# EAGLE design MiniBee (EAGLE 5.06)
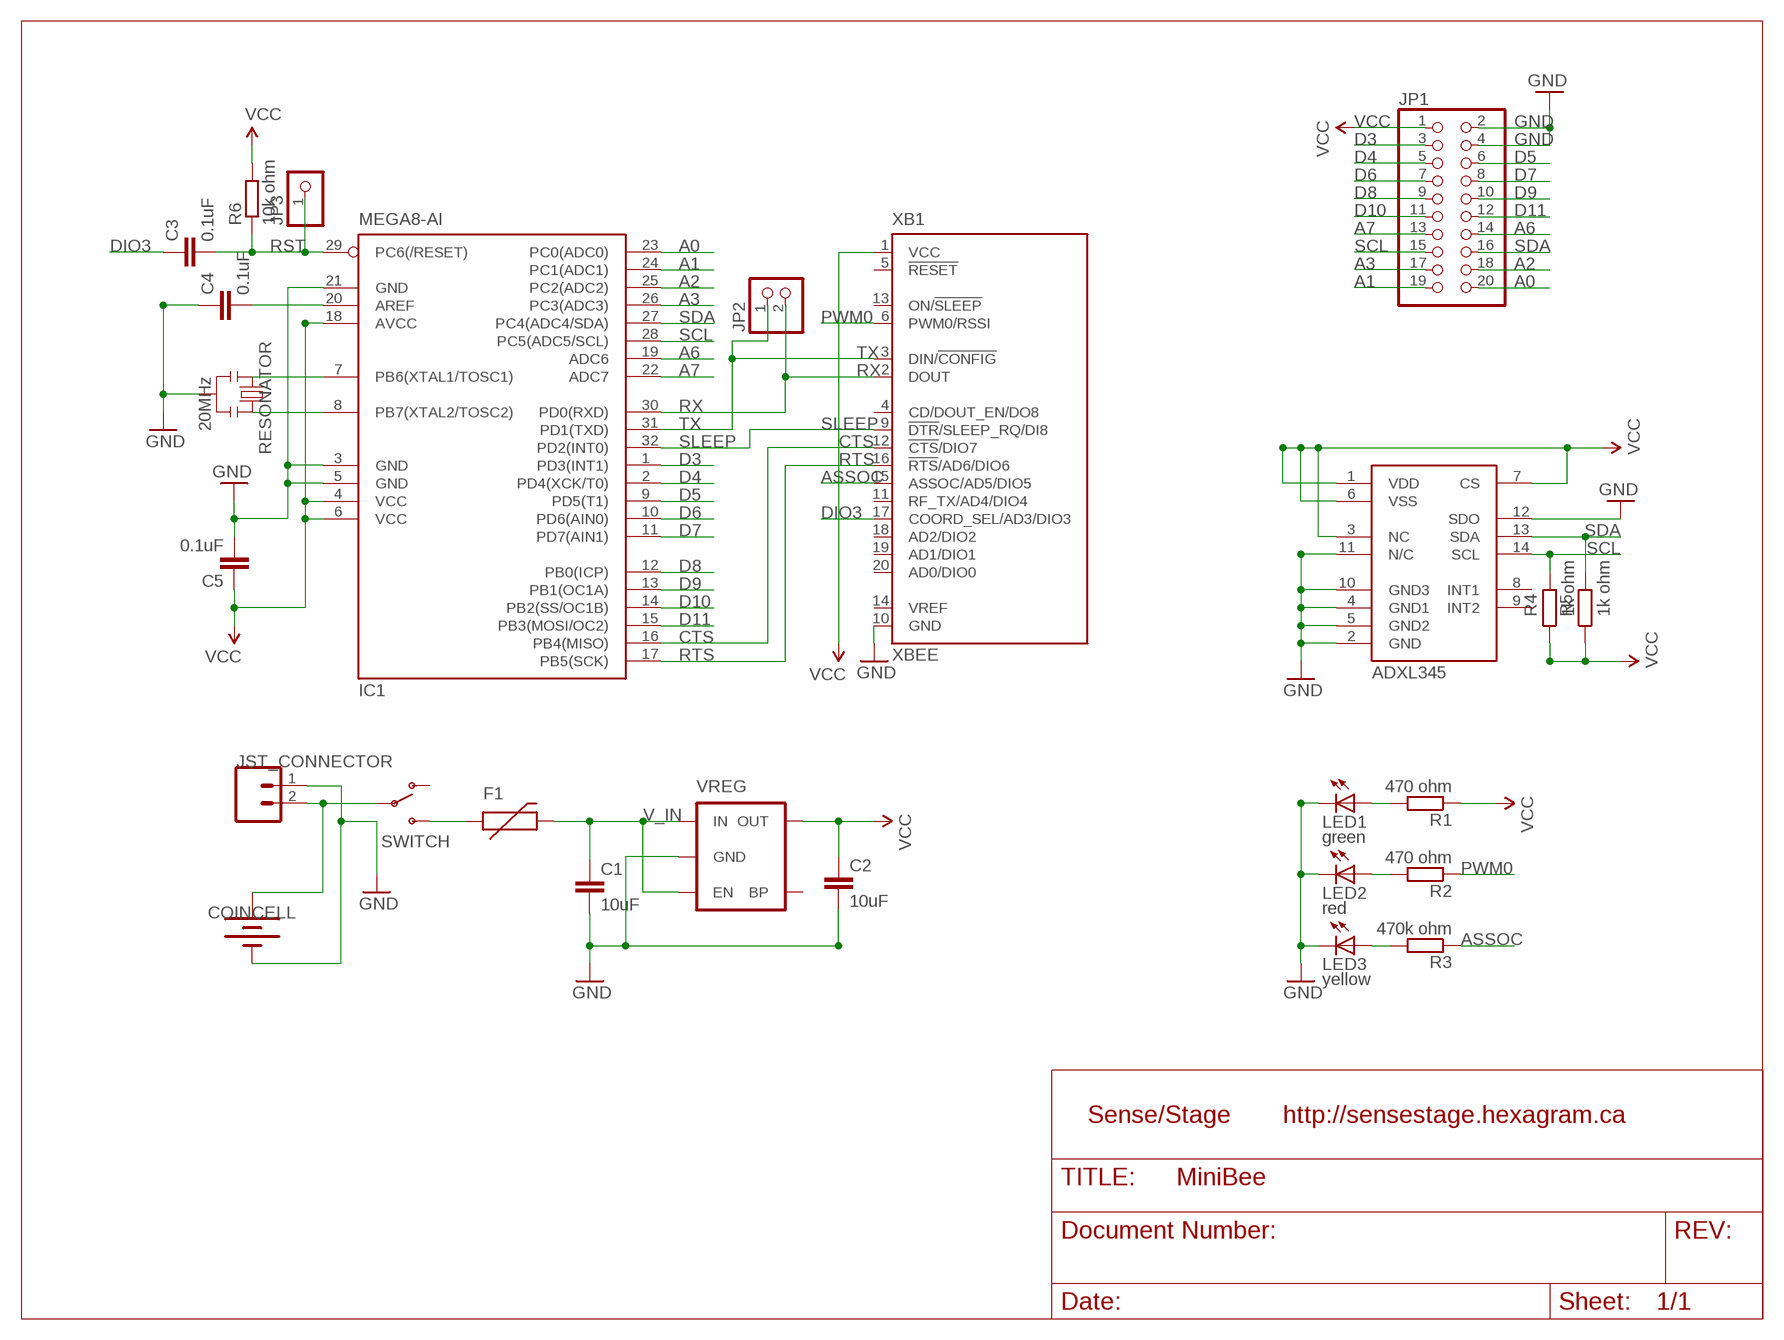
[diagram p0: schematic, sheet 1]

## Parts
C1  10uF  C-EUC0805  [C0805]
C2  10uF  C-EUC0805  [C0805]
C3  0.1uF  C-EUC0402  [C0402]
C4  0.1uF  C-EUC0402  [C0402]
C5  0.1uF  C-EUC0402  [C0402]
COINCELL  COINCELL  KEYSTONE_BATTERY_HOLDER  [KEYSTONE_BATTERY_HOLDER]
F1  PTCSMD  [PTC-1206]
IC1  MEGA8-AI  [TQFP32-08]
JP1  PINHD-2X10  [2X10]
JP2  PINHD-1X2  [1X02]
JP3  PINHD-1X1  [1X01]
JST_CONNECTOR  JST_CONNECTOR  M02-JST-2MM-SMT  [S2B-PH]
LED1  green  LEDCHIP-LED0603  [CHIP-LED0603]
LED2  red  LEDCHIP-LED0603  [CHIP-LED0603]
LED3  yellow  LEDCHIP-LED0603  [CHIP-LED0603]
R1  470 ohm  R-EU_R0402  [R0402]
R2  470 ohm  R-EU_R0402  [R0402]
R3  470k ohm  R-EU_R0402  [R0402]
R4  1k ohm  R-EU_R0402  [R0402]
R5  1k ohm  R-EU_R0402  [R0402]
R6  10k ohm  R-EU_R0402  [R0402]
RESONATOR  20MHz  RESONATORSMD  [RESONATOR-SMD]
SWITCH  SWITCH  PCM_SWITCH  [PCM_SWITCH_RA]
U1  ADXL345  [LGA14]
VREG  V_REG_LDOSMD  [SOT23-5]
XB1  XBEE  [XBEE]

## Nets
A0: IC1.23(PC0(ADC0)) JP1.20
A1: IC1.24(PC1(ADC1)) JP1.19
A2: IC1.25(PC2(ADC2)) JP1.18
A3: IC1.26(PC3(ADC3)) JP1.17
A6: IC1.19(ADC6) JP1.14
A7: IC1.22(ADC7) JP1.13
ASSOC: R3.1 XB1.15(ASSOC/AD5/DIO5)
CTS: IC1.16(PB4(MISO)) XB1.12(!CTS!/DIO7)
D3: IC1.1(PD3(INT1)) JP1.3
D4: IC1.2(PD4(XCK/T0)) JP1.5
D5: IC1.9(PD5(T1)) JP1.6
D6: IC1.10(PD6(AIN0)) JP1.7
D7: IC1.11(PD7(AIN1)) JP1.8
D8: IC1.12(PB0(ICP)) JP1.9
D9: IC1.13(PB1(OC1A)) JP1.10
D10: IC1.14(PB2(SS/OC1B)) JP1.11
D11: IC1.15(PB3(MOSI/OC2)) JP1.12
DIO3: C3.1 XB1.17(COORD_SEL/AD3/DIO3)
GND: C1.2 C2.2 C4.1 C5.2 COINCELL.- IC1.3(GND) IC1.5(GND) IC1.21(GND) JP1.2 JP1.4 JST_CONNECTOR.1 LED1.C LED2.C LED3.C RESONATOR.2 U1.2(GND) U1.4(GND1) U1.5(GND2) U1.10(GND3) U1.11(N/C) U1.12(SDO) VREG.2(GND) XB1.10(GND)
N$1: IC1.7(PB6(XTAL1/TOSC1)) RESONATOR.1
N$2: IC1.8(PB7(XTAL2/TOSC2)) RESONATOR.3
N$3: LED1.A R1.2
N$4: COINCELL.+ JST_CONNECTOR.2 SWITCH.2(P)
N$6: LED2.A R2.2
N$7: LED3.A R3.2
N$8: F1.1 SWITCH.3(S)
N$9: C4.2 IC1.20(AREF)
PWM0: R2.1 XB1.6(PWM0/RSSI)
RST: C3.2 IC1.29(PC6(/RESET)) JP3.1 R6.1
RTS: IC1.17(PB5(SCK)) XB1.16(!RTS!/AD6/DIO6)
RX: IC1.30(PD0(RXD)) JP2.2 XB1.2(DOUT)
SCL: IC1.28(PC5(ADC5/SCL)) JP1.15 R4.2 U1.14(SCL)
SDA: IC1.27(PC4(ADC4/SDA)) JP1.16 R5.2 U1.13(SDA)
SLEEP: IC1.32(PD2(INT0)) XB1.9(!DTR!/SLEEP_RQ/DI8)
TX: IC1.31(PD1(TXD)) JP2.1 XB1.3(DIN/!CONFIG)
V_IN: C1.1 F1.2 VREG.1(IN) VREG.3(EN)
VCC: C2.1 C5.1 IC1.4(VCC) IC1.6(VCC) IC1.18(AVCC) JP1.1 R1.1 R4.1 R5.1 R6.2 U1.1(VDD) U1.3(NC) U1.6(VSS) U1.7(CS) VREG.5(OUT) XB1.1(VCC)
Unconnected: SWITCH.1(O) U1.8(INT1) U1.9(INT2) VREG.4(BP) XB1.4(CD/DOUT_EN/DO8) XB1.5(!RESET) XB1.11(RF_TX/AD4/DIO4) XB1.13(ON/!SLEEP) XB1.14(VREF) XB1.18(AD2/DIO2) XB1.19(AD1/DIO1) XB1.20(AD0/DIO0)

## Notes on the sheet
- Sense/Stage | http://sensestage.hexagram.ca

## Library data of the parts
C1-C5 = rcl:C-EU: CAPACITOR, European symbol
COINCELL = myShit:KEYSTONE_BATTERY_HOLDER
F1 = SparkFun:PTC: Resettable Fuse PTC Resettable Fuse. Spark Fun Electronics SKU : COM-08357
IC1 = atmel:MEGA8: MICROCONTROLLER 8 Kbytes FLASH, 1 kbytes SRAM, 512 bytes EEPROM, USART, 6-channel 10 bit ADC, 2-channel 8 bit ADC Pin compatible with Atmega48, ATMega88, ATMega168 Source: avr.lbr
JP1 = myShit:PINHD-2X10: PIN HEADER
JP2 = myShit:PINHD-1X2: PIN HEADER
JP3 = myShit:PINHD-1X1: PIN HEADER
JST_CONNECTOR = SparkFun:M02: Header 2 Standard 2-pin 0.1" header. Use with straight break away headers (SKU : PRT-00116), right angle break away headers (PRT-00553), swiss pins (PRT-00743), machine pins (PRT-00117), and female headers (PRT-00115). Molex polarized connector foot print use with SKU : PRT-08233 with associated crimp pins and housings.
LED1-LED3 = led:LED: LED OSRAM: - CHIPLED LG R971, LG N971, LY N971, LG Q971, LY Q971, LO R971, LY R971 LH N974, LH R974 LS Q976, LO Q976, LY Q976 LO Q996 - Hyper CHIPLED LW Q18S LB Q993, LB Q99A, LB R99A - SideLED LS A670, LO A670, LY A670, LG A670, LP A670 LB A673, LV A673, LT A673, LW A673 LH A674 LY A675 LS A676, LA A676, LO A676, LY A676, LW A676 LS A679, LY A679, LG A679 - Hyper Micro SIDELED® LS Y876, LA Y876, LO Y876, LY Y876 LT Y87S - SmartLED LW L88C, LW L88S LB L89C, LB L89S, LG L890 LS L89K, LO L89K, LY L89K LS L896, LA L896, LO L896, LY L896 - TOPLED LS T670, LO T670, LY T670, LG T670, LP T670 LSG T670, LSP T670, LSY T670, LOP T670, LYG T670 LG T671, LOG T671, LSG T671 LB T673, LV T673, LT T673, LW T673 LH T674 LS T676, LA T676, LO T676, LY T676, LB T676, LH T676, LSB T676, LW T676 LB T67C, LV T67C, LT T67C, LS T67K, LO T67K, LY T67K, LW E67C LS E67B, LA E67B, LO E67B, LY E67B, LB E67C, LV E67C, LT E67C LW T67C LS T679, LY T679, LG T679 LS T770, LO T770, LY T770, LG T770, LP T770 LB T773, LV T773, LT T773, LW T773 LH T774 LS E675, LA E675, LY E675, LS T675 LS T776, LA T776, LO T776, LY T776, LB T776 LHGB T686 LT T68C, LB T68C - Hyper Mini TOPLED® LB M676 - Mini TOPLED Santana® LG M470 LS M47K, LO M47K, LY M47K Source: http://www.osram.convergy.de LUXEON: - LUMILED® LXK2-PW12-R00, LXK2-PW12-S00, LXK2-PW14-U00, LXK2-PW14-V00 LXK2-PM12-R00, LXK2-PM12-S00, LXK2-PM14-U00 LXK2-PE12-Q00, LXK2-PE12-R00, LXK2-PE12-S00, LXK2-PE14-T00, LXK2-PE14-U00 LXK2-PB12-K00, LXK2-PB12-L00, LXK2-PB12-M00, LXK2-PB14-N00, LXK2-PB14-P00, LXK2-PB14-Q00 LXK2-PR12-L00, LXK2-PR12-M00, LXK2-PR14-Q00, LXK2-PR14-R00 LXK2-PD12-Q00, LXK2-PD12-R00, LXK2-PD12-S00 LXK2-PH12-R00, LXK2-PH12-S00 LXK2-PL12-P00, LXK2-PL12-Q00, LXK2-PL12-R00 Source: www.luxeon.com KINGBRIGHT: KA-3528ASYC Source: www.kingbright.com
R1-R6 = rcl:R-EU_: RESISTOR, European symbol
RESONATOR = SparkFun:RESONATOR: Resonator Small SMD resonator. This is the itty bitty 10/20MHz resonators with built in caps. CSTCE10M0G55 and CSTCE20M0V53. Footprint has been reviewed closely but hasn't been tested yet.
SWITCH = myShit:PCM_SWITCH
U1 = SparkFun:ADXL345
VREG = SparkFun:V_REG_LDO: Voltage Regulator LDO Standard 150mA LDO voltage regulator in SOT-23 layout. Micrel part MIC5205. BP (by-pass) pin is used to lower output noise with 470pF cap.
XB1 = maxstream:XBEE: XBee (TM) /XBee-PRO(TM) OEM RF Modules Source: MaxStream, Inc. xbee_productmanual.pdf

## Board
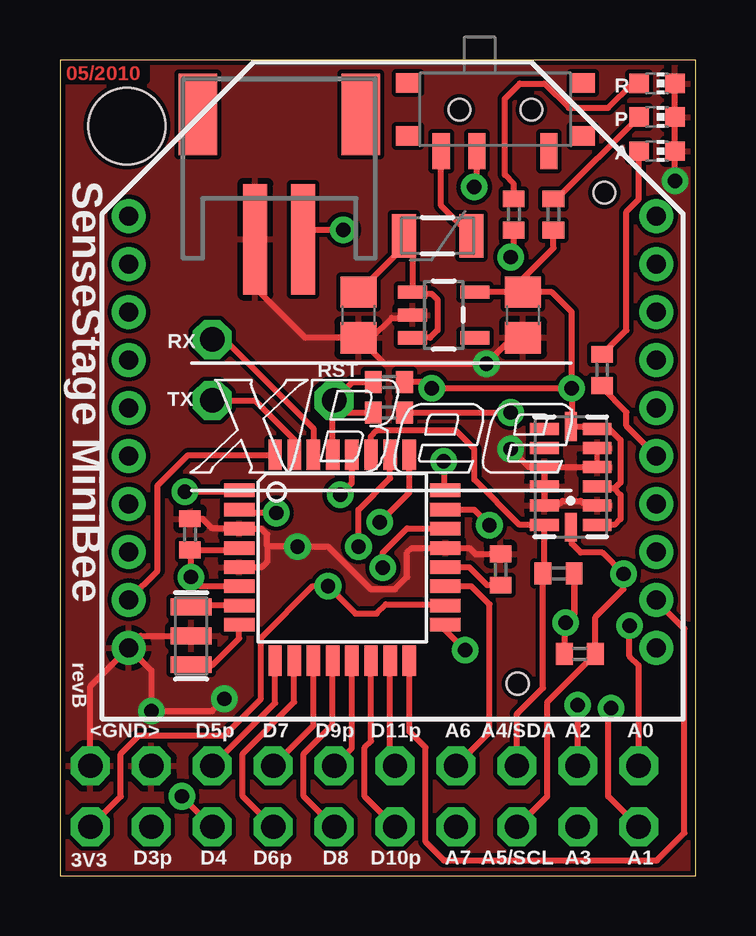
[diagram p1: board, top side]
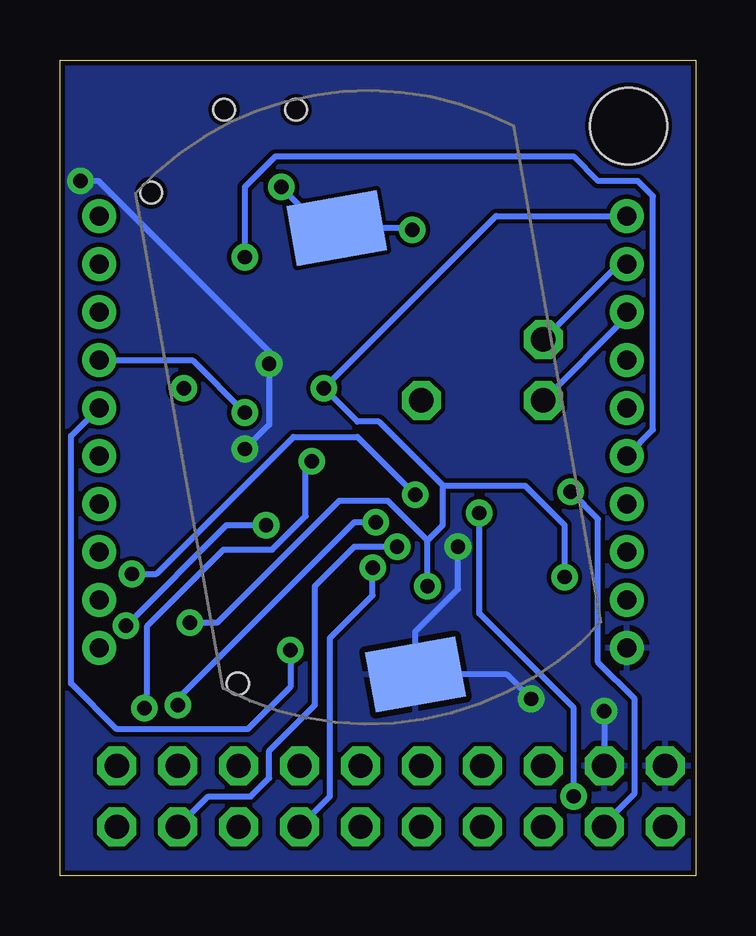
[diagram p2: board, bottom side, seen from below]

Size 26.5 x 34 mm. Coordinates in mm from the lower left corner, seen from the top.
Outline: 0,0 26.5,0 26.5,34 0,34 0,0
Copper layers (1*16): Top 0.035mm / dielectric 1.5mm / Bottom 0.035mm
Design rules "APC": minimum track width 7mil, minimum drill 20mil, track to track 7mil, track to pad 7mil, pad to pad 7mil, via to via 7mil, smd to smd 0mil, copper to edge 8mil, drill to drill 8mil, minimum pad ring 12mil, minimum via ring 10mil, stop-mask expansion 4mil, vias tented up to drill 25mil, thermal gap 10mil
Holes 3.2 mm at 2.79,31.24

### Footprints (pad centres in the part's own frame; a part is rotated, then mirrored left to right if it is on the bottom)
C0805 = smd 1.3 x 1.5: 1 -0.95,0; 2 0.95,0
C0402 = smd 0.7 x 0.9: 1 -0.65,0; 2 0.65,0
KEYSTONE_BATTERY_HOLDER = smd 2.54 x 3.81: + 7.595,0; - -11.303,0 | hole 0.914: 10.389,7.366; -10.389,7.366
PTC-1206 = smd 1 x 1.8: 1 -1.4,0; 2 1.4,0
TQFP32-08 = smd 1.27 x 0.559: 1 -4.293,2.8; 2 -4.293,2; 3 -4.293,1.2; 4 -4.293,0.4; 5 -4.293,-0.4; 6 -4.293,-1.2; 7 -4.293,-2; 8 -4.293,-2.8; 17 4.293,-2.8; 18 4.293,-2; 19 4.293,-1.2; 20 4.293,-0.4; 21 4.293,0.4; 22 4.293,1.2; 23 4.293,2; 24 4.293,2.8 | smd 0.559 x 1.27: 9 -2.8,-4.293; 10 -2,-4.293; 11 -1.2,-4.293; 12 -0.4,-4.293; 13 0.4,-4.293; 14 1.2,-4.293; 15 2,-4.293; 16 2.8,-4.293; 25 2.8,4.293; 26 2,4.293; 27 1.2,4.293; 28 0.4,4.293; 29 -0.4,4.293; 30 -1.2,4.293; 31 -2,4.293; 32 -2.8,4.293
2X10 = drill 1.016 octagon: 1 -11.43,-1.27; 2 -11.43,1.27; 3 -8.89,-1.27; 4 -8.89,1.27; 5 -6.35,-1.27; 6 -6.35,1.27; 7 -3.81,-1.27; 8 -3.81,1.27; 9 -1.27,-1.27; 10 -1.27,1.27; 11 1.27,-1.27; 12 1.27,1.27; 13 3.81,-1.27; 14 3.81,1.27; 15 6.35,-1.27; 16 6.35,1.27; 17 8.89,-1.27; 18 8.89,1.27; 19 11.43,-1.27; 20 11.43,1.27
1X02 = drill 1.016 octagon: 1 -1.27,0; 2 1.27,0
1X01 = drill 1.016 octagon: 1 0,0
S2B-PH = smd 1 x 4.6: 1 -1,-3.7; 2 1,-3.7 | smd 1.6 x 3.4: NC1 -3.4,1.5; NC2 3.4,1.5
CHIP-LED0603 = smd 0.8 x 0.8: A 0,-0.75; C 0,0.75
R0402 = smd 0.7 x 0.9: 1 -0.65,0; 2 0.65,0
RESONATOR-SMD = smd 0.7 x 1.7: 1 -1.2,0; 2 0,0; 3 1.2,0
PCM_SWITCH_RA = smd 0.711 x 1.499: 1 -2.235,1.74; 2 0.762,1.74; 3 2.261,1.74 | smd 0.991 x 0.813: P$1 -3.645,1.105; P$2 -3.645,-1.105; P$4 3.645,-1.105; P$5 3.645,1.105 | hole 0.889: 1.499,0; -1.499,0
LGA14 = smd 0.5 x 1.2: 1 2,1.1; 2 1.2,1.1; 3 0.4,1.1; 4 -0.4,1.1; 5 -1.2,1.1; 6 -2,1.1; 8 -2,-1.1; 9 -1.2,-1.1; 10 -0.4,-1.1; 11 0.4,-1.1; 12 1.2,-1.1; 13 2,-1.1 | smd 1.2 x 0.5: 7 -2.1,0; 14 2.1,0
SOT23-5 = smd 0.55 x 1.2: 1 -0.95,-1.3; 2 0,-1.3; 3 0.95,-1.3; 4 0.95,1.3; 5 -0.95,1.3
XBEE = drill 0.8 pad 1.27 round: 1 -11,9; 2 -11,7; 3 -11,5; 4 -11,3; 5 -11,1; 6 -11,-1; 7 -11,-3; 8 -11,-5; 9 -11,-7; 10 -11,-9; 11 11,-9; 12 11,-7; 13 11,-5; 14 11,-3; 15 11,-1; 16 11,1; 17 11,3; 18 11,5; 19 11,7; 20 11,9

### Placement (x,y rotation side)
C1  12.45,23.37 270 top
C2  19.3,23.37 270 top
C3  13.72,19.3 180 top
C4  18.37,12.75 270 top
C5  5.42,14.22 90 top
COINCELL  13.64,19.51 100 bottom
F1  15.75,26.67 180 top
IC1  11.77,13.25 0 top
JP1  12.7,3.3 0 top
JP2  6.35,21.08 90 top
JP3  11.43,19.81 0 top
JST_CONNECTOR  9.14,30.23 0 top
LED1  24.89,31.62 270 top
LED2  24.89,33.02 270 top
LED3  24.89,30.2 270 top
R1  20.57,27.56 90 top
R2  18.92,27.56 90 top
R3  470 ohm  [R0402]  22.61,21.08 90 top
R4  21.68,9.24 0 top
R5  20.79,12.59 180 top
R6  13.72,20.57 0 top
RESONATOR  12MHz  [RESONATOR-SMD]  5.47,9.99 270 top
SWITCH  18.16,31.93 180 top
U1  21.3,16.62 270 top
VREG  16,23.37 270 top
XB1  13.87,18.49 0 top

### Tracks (layer width: path | path; a pad name or v marks a point on that pad's centre or on a via)
A0  (via drill 0.6)
  Top 0.254: v17.91,14.61 17.27,15.24 16.08,15.24 IC1.23 | JP1.20 24.13,8.76 23.75,9.14 v23.75,10.41
  Bottom 0.254: v23.75,10.41 19.56,14.61 v17.91,14.61
A1  (via drill 0.6)
  Top 0.254: JP1.19 22.86,3.3 22.86,6.86 v22.99,6.99 | v16,17.27 16,16.11 IC1.24
  Bottom 0.254: v22.99,6.99 22.99,7.11 22.86,7.24 22.86,10.41 19.68,13.59 17.65,13.59 16.26,14.99 16.26,17.02 v16,17.27
A2  (via drill 0.6)
  Top 0.254: IC1.25 14.57,15.97 v13.34,14.73 | JP1.18 v21.59,7.11
  Bottom 0.254: v21.59,7.11 21.59,7.37 14.22,14.73 v13.34,14.73
A3  (via drill 0.6)
  Top 0.254: IC1.26 13.77,16.56 12.45,15.24 v12.45,13.72
  Bottom 0.254: JP1.17 20.32,3.3 18.54,3.3 17.78,4.06 17.78,5.21 15.88,7.11 15.88,12.06 14.22,13.72 v12.45,13.72
A6
  Top 0.254: IC1.19 17.16,12.05 17.91,11.3 17.91,5.97 JP1.14
A7  (via drill 0.6)
  Top 0.254: IC1.22 16.04,14.48 14.48,14.48 13.46,13.46 v13.46,12.83
  Bottom 0.254: JP1.13 15.24,3.3 15.24,9.91 13.46,11.68 v13.46,12.83
ASSOC
  Top 0.254: R3.1 22.61,20.32 23.62,19.3 23.62,18.74 XB1.15
CTS
  Top 0.254: IC1.16 14.57,6 15.24,5.33 15.24,1.4 16,0.64 24.89,0.64 26.04,1.78 26.04,10.29 24.87,11.45 XB1.12
D3  (via drill 0.6)
  Top 0.254: v5.21,16 7.42,16 IC1.1
  Bottom 0.254: JP1.3 3.81,2.16 2.54,3.43 2.54,7.37 4.06,8.89 4.06,14.86 v5.21,16
D4  (via drill 0.6)
  Top 0.254: JP1.5 v5.08,3.3 | v9.02,15.11 7.62,15.11 IC1.2
  Bottom 0.254: v5.08,3.3 5.08,6.99 9.02,10.92 v9.02,15.11
D5
  Top 0.254: IC1.9 8.97,7.19 JP1.6
D6
  Top 0.254: IC1.10 9.77,7.23 7.62,5.08 7.62,3.3 JP1.7
D7
  Top 0.254: IC1.11 10.57,6.25 JP1.8
D8
  Top 0.254: IC1.12 11.37,6.29 10.16,5.08 10.16,3.3 JP1.9
D9
  Top 0.254: IC1.13 12.17,5.31 JP1.10
D10
  Top 0.254: IC1.14 12.97,5.6 12.7,5.33 12.7,3.3 JP1.11
D11
  Top 0.254: IC1.15 13.77,4.77 JP1.12
DIO3  (via drill 0.6)
  Top 0.254: C3.1 v18.8,19.3
  Bottom 0.254: v18.8,19.3 20.95,21.46 24.84,21.46 XB1.17
GND  (via drill 0.6)
  Top 0.203: U1.4 U1.5
  Top 0.254: U1.10 U1.11 U1.12 20.63,15.42 20.7,15.49 20.83,15.49 20.95,15.62 21.72,15.62 21.84,15.49 22.32,15.49 U1.2 | U1.10 U1.4 | C4.1 17.32,13.4 17.07,13.65 IC1.21 14.67,13.65 14.48,13.46 14.48,12.45 13.97,11.94 12.95,11.94 11.18,13.72 v9.91,13.72 8.64,13.72 | C5.2 5.96,14.87 6.35,14.48 7.45,14.48 IC1.3 8.41,14.45 8.64,14.22 8.64,13.72 | IC1.5 8.41,12.85 8.64,13.08 8.64,13.72 | C1.2 13.02,22.42 13.84,23.24 14.57,23.24 VREG.2 | C1.2 10.22,22.42 8.13,24.51 8.13,26.51 JST_CONNECTOR.1 | U1.10 19.55,17.02 v18.8,17.78 | C2.2 18.86,22.42 v17.78,21.34 13.53,21.34 C1.2 | v25.65,28.96 v25.64,28.97 LED3.C LED1.C LED2.C | RESONATOR.2 3.37,9.99 XB1.10 | JP1.2 1.27,7.89 XB1.10 | XB1.10 3.81,8.55 v3.81,6.86 6.35,6.86 v6.86,7.37
  Bottom 0.254: v18.8,17.78 17.78,18.8 v17.78,21.34 17.78,21.84 24.89,28.96 v25.65,28.96 | v9.91,13.72 9.91,11.94 11.68,10.17 COINCELL.- 7.88,8.38 v6.86,7.37 | v3.81,6.86 JP1.4
  pour Top: 0,34 26.5,34 26.5,0 0,0
  pour Bottom: 0,34 26.5,34 26.5,0 0,0
N$1
  Top 0.254: IC1.7 5.53,11.25 RESONATOR.1
N$2
  Top 0.254: IC1.8 7.48,9.89 6.35,8.76 5.5,8.76 RESONATOR.3
N$3
  Top 0.254: LED1.A 20.73,28.21 R1.2
N$4  (via drill 0.6)
  Top 0.254: SWITCH.2 17.39,28.82 v17.27,28.7 | v11.81,26.92 10.54,26.92 JST_CONNECTOR.2
  Bottom 0.254: v17.27,28.7 15.49,26.92 15.03,26.92 COINCELL.+ 11.88,26.99 v11.81,26.92
N$6
  Top 0.254: LED2.A 23.88,33.02 22.86,32 21.21,32 20.19,33.02 19.18,33.02 18.54,32.38 18.54,29.21 18.92,28.83 R2.2
N$7
  Top 0.254: R3.2 23.62,22.73 23.62,27.69 24.13,28.19 LED3.A
N$8
  Top 0.254: SWITCH.3 15.89,27.92 F1.1
N$9
  Top 0.254: C4.2 17.82,12.1 17.07,12.85 IC1.20
PWM0  (via drill 0.6)
  Top 0.254: R2.1 18.92,25.91 v18.8,25.78
  Bottom 0.254: v18.8,25.78 18.8,28.7 17.53,29.97 5.08,29.97 4.06,28.96 2.41,28.96 1.78,28.32 1.78,18.59 XB1.6
RST
  Top 0.254: IC1.29 11.37,19.75 JP3.1 | C3.2 11.94,19.3 JP3.1 | R6.1 12.19,20.57 JP3.1
RTS  (via drill 0.6)
  Top 0.254: IC1.17 16.06,10.23 v16.89,9.4
  Bottom 0.254: v16.89,9.4 16.89,7.87 18.67,6.1 24.13,6.1 26.04,8 26.04,18.33 XB1.16
RX
  Top 0.254: IC1.30 10.57,18.64 6.86,22.35 JP2.2
  Bottom 0.254: XB1.2 3.21,25.49 JP2.2
SCL  (via drill 0.6)
  Top 0.254: IC1.28 12.17,16.36 v11.68,15.88 | U1.14 21.34,14.48 21.34,13.84 21.72,13.46 22.61,13.46 v23.5,12.57 23.5,11.94 22.33,10.77 R4.2 20.32,7.23 20.32,3.3 JP1.15
  Bottom 0.254: v23.5,12.57 22.48,12.57 16.76,18.29 14.1,18.29 v11.68,15.88
SDA
  Top 0.254: IC1.27 12.95,17.56 12.95,18.29 13.21,18.54 16.51,18.54 17.27,17.78 17.27,16.51 19.16,14.62 U1.13 20.19,12.65 R5.2 20.14,7.82 19.05,6.73 JP1.16
SLEEP
  Top 0.254: XB1.9 2.87,11.51 4.06,12.7 4.06,16.26 5.33,17.53 8.95,17.53 IC1.32
TX
  Top 0.254: IC1.31 9.77,18.17 8.13,19.81 JP2.1
  Bottom 0.254: XB1.3 2.87,23.29 JP2.1
V_IN
  Top 0.254: C1.1 14.35,26.22 F1.2 14.7,26.32 VREG.1 14.76,24.26 15.49,24.26 15.75,24 15.75,22.73 15.43,22.42 VREG.3
VCC  (via drill 0.6)
  Top 0.203: 22.3,18.72 U1.6 22.5,18.72
  Top 0.254: 22.3,18.72 U1.7 21.34,18.76 v21.34,20.32 | IC1.4 7.39,13.57 C5.1 5.46,13.54 v5.46,12.45 5.84,12.06 7.47,12.06 IC1.6 | C2.1 19.3,24.89 20.57,26.16 R1.1 | C2.1 VREG.5 | C2.1 20.51,24.32 21.34,23.5 v21.34,20.32 | v21.34,20.32 v15.49,20.32 15.24,20.57 R6.2 | IC1.18 16.01,11.3 13.59,11.3 13.21,10.92 12.32,10.92 v11.18,12.06 10.54,12.06 8.38,9.91 8.38,7.37 6.86,5.84 3.3,5.84 2.54,5.08 2.54,3.3 JP1.1 | U1.1 23.13,14.62 23.37,14.86 23.37,15.88 23.11,16.13 | 23.11,16.13 22.49,16.13 U1.3 | U1.6 22.91,18.62 23.37,18.16 23.37,16.38 23.11,16.13 | R4.1 21.03,10.49 v21.08,10.54 21.44,10.9 | 21.44,10.9 21.46,10.92 21.46,12.57 R5.1 21.44,10.9
  Bottom 0.254: 10.54,16.26 13.21,18.92 14.1,18.92 v15.49,20.32 8.32,27.49 XB1.1 | v21.08,10.54 19.94,10.54 14.86,15.62 12.83,15.62 11.18,13.97 | v5.46,12.45 5.46,14.61 7.11,16.26 10.54,16.26 | v11.18,12.06 11.18,13.97 | 10.54,16.26 10.54,14.61 11.18,13.97

### Text on the board
Top: 05/2010
_tsilk: R | P | A | SenseStage MiniBee | RX | RST | TX | revB | <GND> | D5p | D7 | D9p | D11p | A6 | A4/SDA | A2 | A0 | 3V3 | D3p | D4 | D6p | D8 | D10p | A7 | A5/SCL | A3 | A1